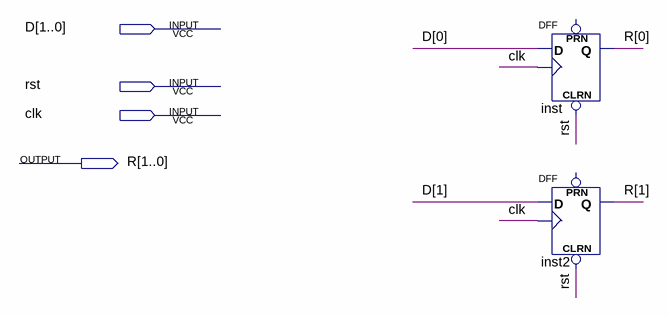
[diagram p0: schematic sheet]
// Quartus schematic Reg8b.bdf as structural Verilog: 2 symbols, 4 pins
module Reg8b (
  input  [1:0] D,
  input  rst,
  input  clk,
  output [1:0] R
);

  DFF inst (.CLRN(rst), .CLK(clk), .D(D[0]), .Q(R[0]));  // open: PRN
  DFF inst2 (.CLRN(rst), .CLK(clk), .D(D[1]), .Q(R[1]));  // open: PRN
endmodule
